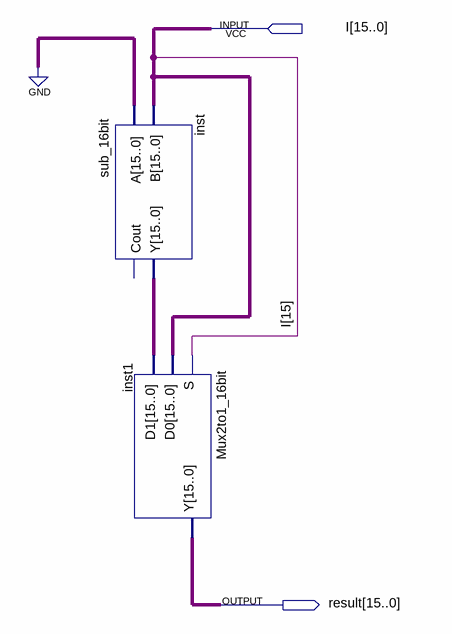
[diagram p0: schematic sheet]
// Quartus schematic ABS.bdf as structural Verilog: 2 symbols, 2 pins
module ABS (
  input  [15:0] I,
  output [15:0] result
);

  wire [15:0] inst_y;

  sub_16bit inst (.A({16{1'b0}}), .B(I), .Y(inst_y));  // open: Cout
  Mux2to1_16bit inst1 (.S(I[15]), .D0(I), .D1(inst_y), .Y(result));
endmodule
